# Altium project alarmClock.PrjPcb
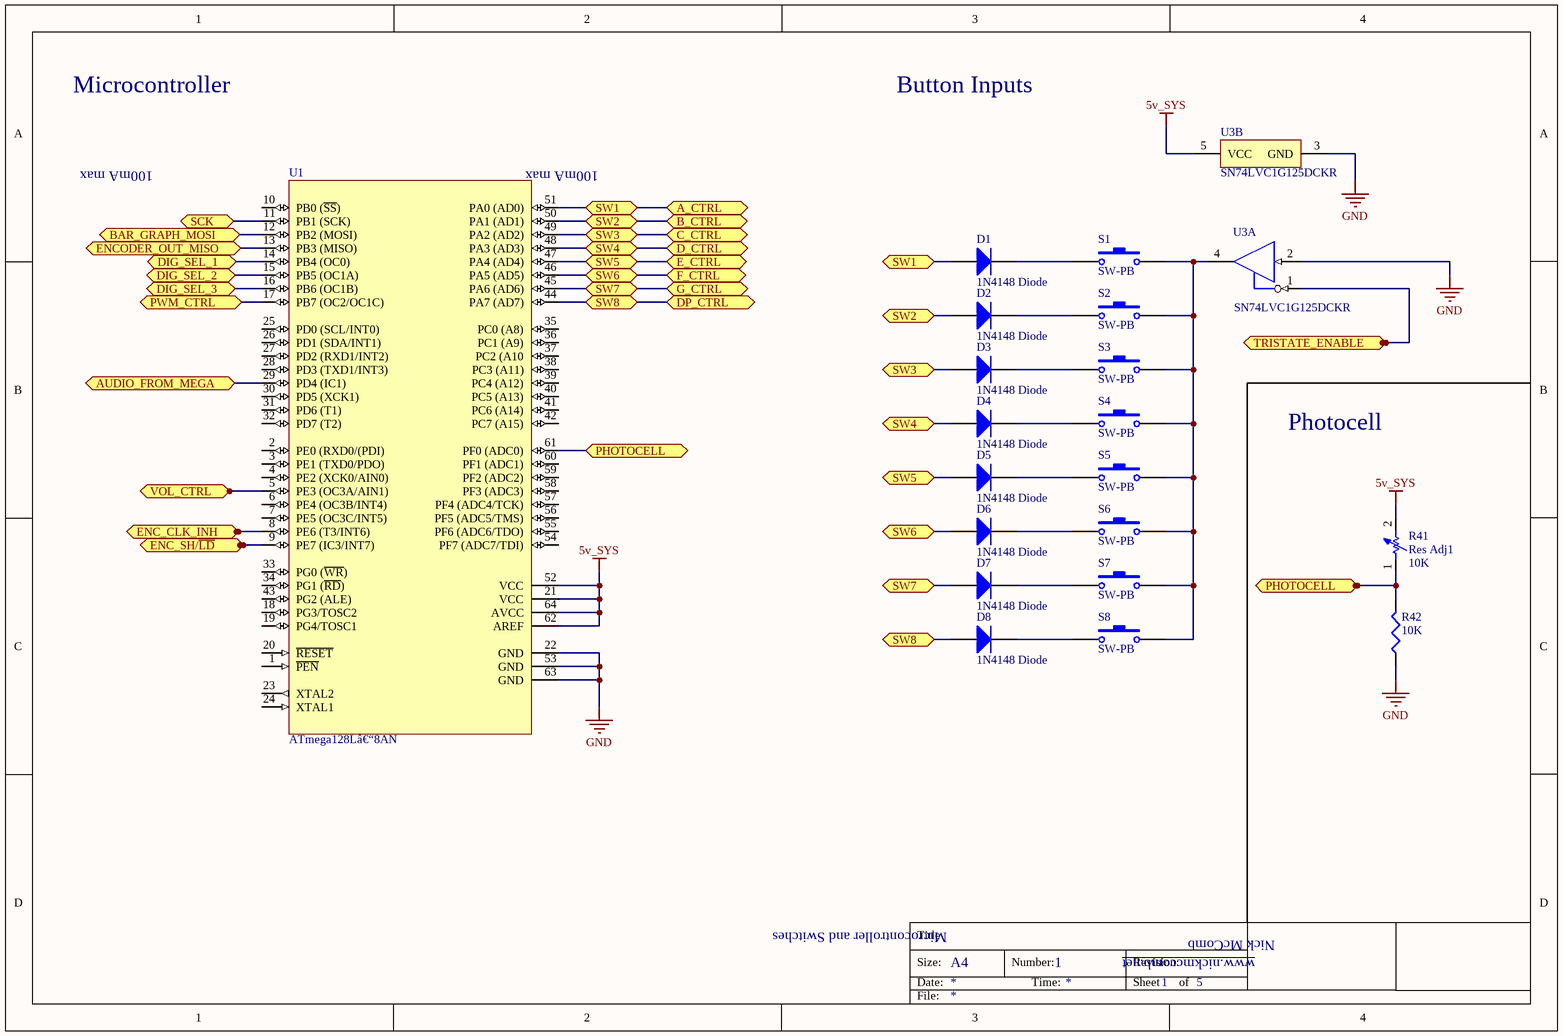
[diagram p0: uC.SchDoc]
5 sheets, 105 parts. Net scope: flat (ports and power ports of the same name join across sheets).
Sheets:
  uC.SchDoc
  barGraph.SchDoc
  7Seg.SchDoc
  encoder.SchDoc
  audioAmp.SchDoc

## Sheet uC.SchDoc
size A4; Organization: Altium Limited; Address1: L3, 12a Rodborough Rd; Address2: Frenchs Forest; Address3: NSW; Address4: Australia 2086; DocumentNumber: 1; SheetNumber: 1; SheetTotal: 5

### Parts
D1  1N4148 Diode  [S01575 Diode]
D2  1N4148 Diode  [S01575 Diode]
D3  1N4148 Diode  [S01575 Diode]
D4  1N4148 Diode  [S01575 Diode]
D5  1N4148 Diode  [S01575 Diode]
D6  1N4148 Diode  [S01575 Diode]
D7  1N4148 Diode  [S01575 Diode]
D8  1N4148 Diode  [S01575 Diode]
R41  Res Adj1  value 10K  [LOG POT]
R42  10K  [J1-0603]
S1  SW-PB  [SW-PB]
S2  SW-PB  [SW-PB]
S3  SW-PB  [SW-PB]
S4  SW-PB  [SW-PB]
S5  SW-PB  [SW-PB]
S6  SW-PB  [SW-PB]
S7  SW-PB  [SW-PB]
S8  SW-PB  [SW-PB]
U1  ATmega128Lâ€“8AN  [64A_M]
U3  SN74LVC1G125DCKR  [DCK0005A_M]  (parts A,B of 2)

### Ports
A_CTRL, AUDIO_FROM_MEGA, B_CTRL, BAR_GRAPH_MOSI, C_CTRL, D_CTRL, DIG_SEL_1, DIG_SEL_2, DIG_SEL_3, DP_CTRL, E_CTRL, ENC_CLK_INH, ENC_SH/~{LD}, ENCODER_OUT_MISO, F_CTRL, G_CTRL, PHOTOCELL, PWM_CTRL, SCK, SW1, SW2, SW3, SW4, SW5, SW6, SW7, SW8, TRISTATE_ENABLE, VOL_CTRL

### Nets
5v_SYS: R41.2 U1.21(VCC) U1.52(VCC) U1.62(AREF) U1.64(AVCC) U3.5(VCC)
GND: R42.1 U1.22(GND) U1.53(GND) U1.63(GND) U3.2(A) U3.3(GND)
NetC3_1: U1.29(PD4_(IC1)) ; port AUDIO_FROM_MEGA
NetD1_1: D1.1(K) S1.1
NetD1_3: D1.3(A) U1.51(PA0_(AD0)) ; port SW1, port A_CTRL
NetD2_1: D2.1(K) S2.1
NetD2_3: D2.3(A) U1.50(PA1_(AD1)) ; port SW2, port B_CTRL
NetD3_1: D3.1(K) S3.1
NetD3_3: D3.3(A) U1.49(PA2_(AD2)) ; port SW3, port C_CTRL
NetD4_1: D4.1(K) S4.1
NetD4_3: D4.3(A) U1.48(PA3_(AD3)) ; port SW4, port D_CTRL
NetD5_1: D5.1(K) S5.1
NetD5_3: D5.3(A) U1.47(PA4_(AD4)) ; port SW5, port E_CTRL
NetD6_1: D6.1(K) S6.1
NetD6_3: D6.3(A) U1.46(PA5_(AD5)) ; port SW6, port F_CTRL
NetD7_1: D7.1(K) S7.1
NetD7_3: D7.3(A) U1.45(PA6_(AD6)) ; port SW7, port G_CTRL
NetD8_1: D8.1(K) S8.1
NetD8_3: D8.3(A) U1.44(PA7_(AD7)) ; port SW8, port DP_CTRL
NetR30_1: U1.17(PB7_(OC2/OC1C)) ; port PWM_CTRL
NetR41_1: R41.1 R42.2 U1.61(PF0_(ADC0)) ; port PHOTOCELL
NetR45_1: U1.5(PE3_(OC3A/AIN1)) ; port VOL_CTRL
NetS1_2: S1.2 S2.2 S3.2 S4.2 S5.2 S6.2 S7.2 S8.2 U3.4(Y)
NetU1_8: U1.8(PE6_(T3/INT6)) ; port ENC_CLK_INH
NetU1_9: U1.9(PE7_(IC3/INT7)) ; port ENC_SH/~{LD}
NetU1_11: U1.11(PB1_(SCK)) ; port SCK
NetU1_12: U1.12(PB2_(MOSI)) ; port BAR_GRAPH_MOSI
NetU1_13: U1.13(PB3_(MISO)) ; port ENCODER_OUT_MISO
NetU1_14: U1.14(PB4_(OC0)) ; port DIG_SEL_1
NetU1_15: U1.15(PB5_(OC1A)) ; port DIG_SEL_2
NetU1_16: U1.16(PB6_(OC1B)) ; port DIG_SEL_3
NetU2_7: U3.1(~{OE}) ; port TRISTATE_ENABLE

Not connected (* = marked no-connect by the designer): U1 1(~{PEN}) 2(PE0_(RXD0/(PDI)) 3(PE1_(TXD0/PDO)) 4(PE2_(XCK0/AIN0)) 6(PE4_(OC3B/INT4)) 7(PE5_(OC3C/INT5)) 10(PB0_(~{SS})) 18(PG3/TOSC2) 19(PG4/TOSC1) 20(~{RESET}) 23(XTAL2) 24(XTAL1) 25(PD0_(SCL/INT0)) 26(PD1_(SDA/INT1)) 27(PD2_(RXD1/INT2)) 28(PD3_(TXD1/INT3)) 30(PD5_(XCK1)) 31(PD6_(T1)) 32(PD7_(T2)) 33(PG0_(~{WR})) 34(PG1_(~{RD})) 35(PC0_(A8)) 36(PC1_(A9)) 37(PC2_(A10) 38(PC3_(A11)) 39(PC4_(A12)) 40(PC5_(A13)) 41(PC6_(A14)) 42(PC7_(A15)) 43(PG2_(ALE)) 54(PF7_(ADC7/TDI)) 55(PF6_(ADC6/TDO)) 56(PF5_(ADC5/TMS)) 57(PF4_(ADC4/TCK)) 58(PF3_(ADC3)) 59(PF2_(ADC2)) 60(PF1_(ADC1))

### Notes on the sheet
- Microcontroller
- Button Inputs
- 100mA max
- Photocell
- Microcontroller and Switches
- Title
- Size:
- Date:
- A4
- Number:
- Time:
- Revision:
- Sheet
- of
- www.nickmccomb.net
- Nick McComb
- File:

### Library data of the parts
D1-D8 = Diode
R41 = Res Adj1: Variable Resistor; ComponentLink1URL: http://cdn.sparkfun.com/datasheets/Sensors/LightImaging/SEN-09088.pdf; ComponentLink1Description: A Photocell Datasheet
R42 = Res3: Resistor; Published: 8-Jun-2000; LatestRevisionDate: 29-May-2009; LatestRevisionNote: IPC-7351 Footprint Added.; PackageReference: J1-0603; Publisher: Altium Limited; PackageDescription: Chip Resistor; Value: 10K
S1-S8 = SW-PB: Switch
U1 = CMP-0095-00651-1: 8-bit AVR Microcontroller, 3.0-5.5V, 128KB Flash, 4KB EEPROM, 4KB SRAM, 64-pin TQFP, Extended Grade (-40°C to 105°C); PackageVersion: revC, Oct-2010; PackageDescription: 64-Pin Plastic Thin Profile Quad Flat Pack, 14 x 14 x 1.0 mm Body, 0.8 mm Pitch (TQFP); Code_JEDEC: MS-026-AEB; ComponentLink3Description: ATmega128(L) Summary; ComponentLink1URL: http://www.atmel.com/; PackageReference: 64A; ComponentLink2URL: http://www.atmel.com/dyn/resources/prod_documents/doc2467.pdf; DatasheetVersion: revX, Jun-2011; ComponentLink3URL: http://www.atmel.com/dyn/resources/prod_documents/2467S.pdf; ComponentLink2Description: ATmega128(L) Datasheet; ComponentLink1Description: Manufacturer URL
U3 = CMP-0859-00281-3: Single Bus Buffer Gate With 3-State Outputs, DCK0005A, LARGE T&R; Manufacturer: Texas Instruments; Bits(#): 1; tpd @ Nom Voltage(Max)(ns): 9,5.5,4.5,4; 3-State Output: Yes; Output Type: CMOS; Sub-Family: Non-Inverting Buffer/Driver; Logic: True; Output Drive (IOL/IOH)(Max)(mA): 32/-32; Voltage(Nom)(V): 1.8,2.5,3.3,5; ICC @ Nom Voltage(Max)(mA): 0.01; Technology Family: LVC; VCC(Min)(V): 1.65; VCC(Max)(V): 5.5; F @ Nom Voltage(Max)(Mhz): 150; Rating: Catalog; Input Type: CMOS/TTL; Schmitt Trigger: No; PackageReference: DCK0005A; Generic Part Number: SN74LVC1G125; DatasheetVersion: SCES223T; Operating Temperature Range(C): -40 to 125,-40 to 85; PartId: 1

## Sheet barGraph.SchDoc
size A4; Organization: Altium Limited; Address1: L3, 12a Rodborough Rd; Address2: Frenchs Forest; Address3: NSW; Address4: Australia 2086; DocumentNumber: 2; SheetNumber: 2; SheetTotal: 5
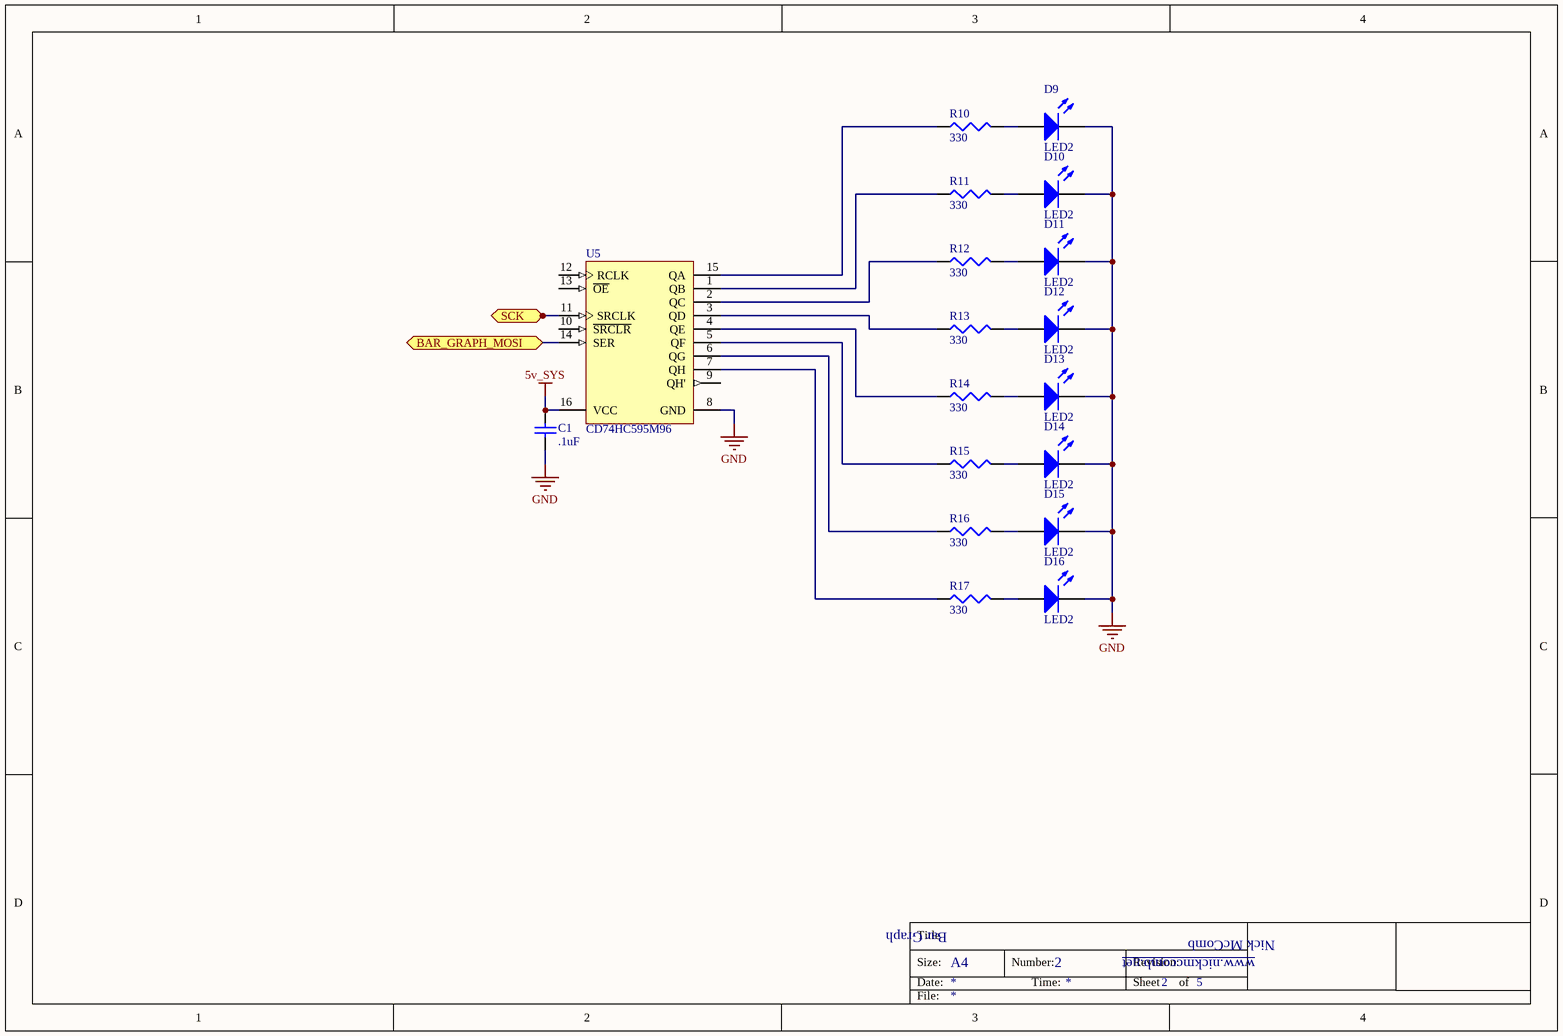
[diagram p1: barGraph.SchDoc]

### Parts
C1  value .1uF  [C0805]  (hidden comment: 0805 style, by default)
D9  LED2  [basic_led]
D10  LED2  [basic_led]
D11  LED2  [basic_led]
D12  LED2  [basic_led]
D13  LED2  [basic_led]
D14  LED2  [basic_led]
D15  LED2  [basic_led]
D16  LED2  [basic_led]
R10  330  [J1-0603]
R11  330  [J1-0603]
R12  330  [J1-0603]
R13  330  [J1-0603]
R14  330  [J1-0603]
R15  330  [J1-0603]
R16  330  [J1-0603]
R17  330  [J1-0603]
U5  CD74HC595M96  [D0016A_L]

### Ports
BAR_GRAPH_MOSI, SCK

### Nets
5v_SYS: C1.2 U5.16(VCC)
GND: C1.1 D9.2(K) D10.2(K) D11.2(K) D12.2(K) D13.2(K) D14.2(K) D15.2(K) D16.2(K) U5.8(GND)
NetD9_1: D9.1(A) R10.2
NetD10_1: D10.1(A) R11.2
NetD11_1: D11.1(A) R12.2
NetD12_1: D12.1(A) R13.2
NetD13_1: D13.1(A) R14.2
NetD14_1: D14.1(A) R15.2
NetD15_1: D15.1(A) R16.2
NetD16_1: D16.1(A) R17.2
NetR10_1: R10.1 U5.15(QA)
NetR11_1: R11.1 U5.1(QB)
NetR12_1: R12.1 U5.2(QC)
NetR13_1: R13.1 U5.3(QD)
NetR14_1: R14.1 U5.4(QE)
NetR15_1: R15.1 U5.5(QF)
NetR16_1: R16.1 U5.6(QG)
NetR17_1: R17.1 U5.7(QH)
NetU1_11: U5.11(SRCLK) ; port SCK
NetU1_12: U5.14(SER) ; port BAR_GRAPH_MOSI

Not connected (* = marked no-connect by the designer): U5 9(QH') 10(~{SRCLR}) 12(RCLK) 13(~{OE})

### Notes on the sheet
- Bar Graph
- Title
- Size:
- Date:
- A4
- Number:
- Time:
- Revision:
- Sheet
- of
- www.nickmccomb.net
- Nick McComb
- File:

### Library data of the parts
C1 = Cap: Capacitor; Published: 8-Jun-2000; LatestRevisionDate: 17-Jul-2002; LatestRevisionNote: Re-released for DXP Platform.; PackageReference: RAD-0.3; Publisher: Altium Limited; PackageDescription: Radial Cap, Thru-Hole; 2 Leads; 0.3 in Pin Spacing
D9-D16 = LED2: Typical RED, GREEN, YELLOW, AMBER GaAs LED; Published: 8-Jun-2000; LatestRevisionDate: 17-Jul-2002; LatestRevisionNote: Re-released for DXP Platform.; PackageVersion: Feb-2002; PackageReference: 3.2X1.6X1.1; Publisher: Altium Limited; PackageDescription: SM LED; 2 Flat Leads
R10-R17 = Res3: Resistor; Published: 8-Jun-2000; LatestRevisionDate: 29-May-2009; LatestRevisionNote: IPC-7351 Footprint Added.; PackageReference: J1-0603; Publisher: Altium Limited; PackageDescription: Chip Resistor; Value: 330
U5 = CMP-0807-00025-1: 8-Bit Shift Registers With 3-State Output Registers, D0016A, LARGE T&R; ICC @ Nom Voltage(Max)(mA): 0.08; 3-State Output: Yes; Input Type: CMOS; VCC(Max)(V): 6; Bits: 8; No. of Outputs: 9; VCC(Min)(V): 2; F @ Nom Voltage(Max)(Mhz): 28; Technology Family: HC; tpd @ Nom Voltage(Max)(ns): 41; Output Drive (IOL/IOH)(Max)(mA): 7.8/-7.8; Rating: Catalog; PackageVersion: http://www.ti.com/lit/ml/mpds178g/mpds178g.pdf; Code_IPC: MS-012 variation AC; Operating Temperature Range(C): -55 to 125; ComponentLink2Description: Datasheet; ComponentLink1Description: Manufacturer URL; ComponentLink2URL: http://www.ti.com/lit/ds/symlink/cd74hc595.pdf; PackageReference: D0016A; PartNumber: CD74HC595M96; Part Number: CD74HC595; DatasheetVersion: SCHS353; ComponentLink1URL: http://www.ti.com/; Output Type: CMOS; Voltage(Nom)(V): 6

## Sheet 7Seg.SchDoc
size A4; Organization: Altium Limited; Address1: L3, 12a Rodborough Rd; Address2: Frenchs Forest; Address3: NSW; Address4: Australia 2086; DocumentNumber: 3; SheetNumber: 3; SheetTotal: 5
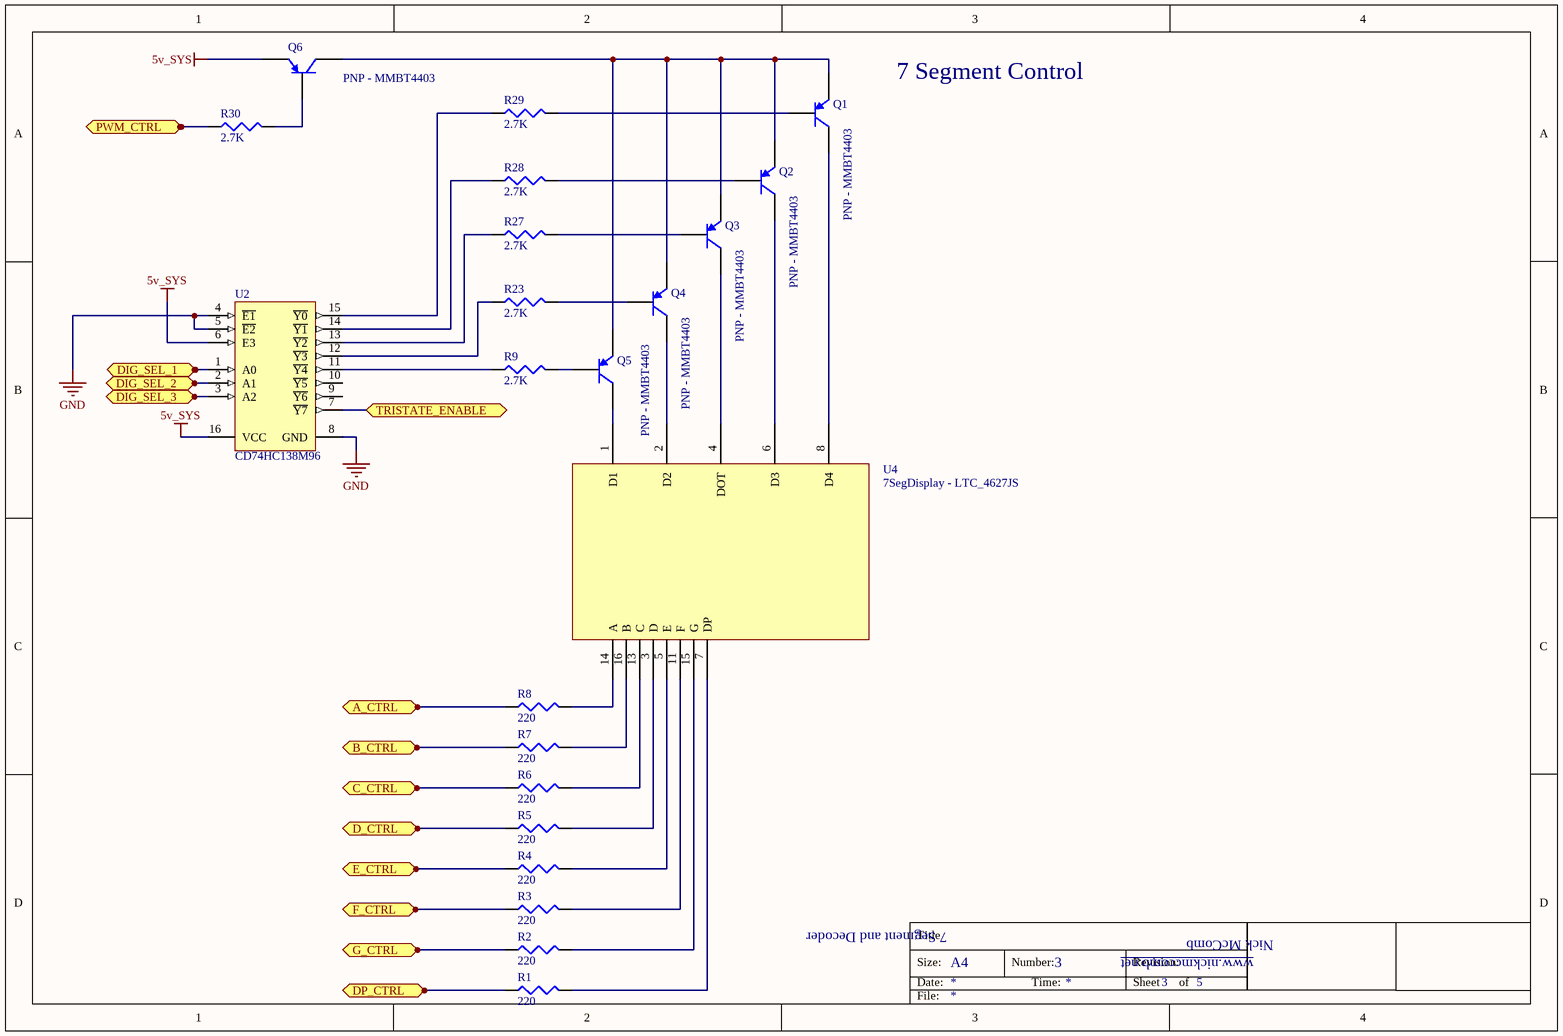
[diagram p2: 7Seg.SchDoc]

### Parts
Q1  PNP - MMBT4403  [TO-92A - BJT]
Q2  PNP - MMBT4403  [TO-92A - BJT]
Q3  PNP - MMBT4403  [TO-92A - BJT]
Q4  PNP - MMBT4403  [TO-92A - BJT]
Q5  PNP - MMBT4403  [TO-92A - BJT]
Q6  PNP - MMBT4403  [TO-92A - BJT]
R1  220  [J1-0603]
R2  220  [J1-0603]
R3  220  [J1-0603]
R4  220  [J1-0603]
R5  220  [J1-0603]
R6  220  [J1-0603]
R7  220  [J1-0603]
R8  220  [J1-0603]
R9  2.7K  [J1-0603]
R23  2.7K  [J1-0603]
R27  2.7K  [J1-0603]
R28  2.7K  [J1-0603]
R29  2.7K  [J1-0603]
R30  2.7K  [J1-0603]
U2  CD74HC138M96  [D0016A_L]
U4  7SegDisplay - LTC_4627JS

### Ports
A_CTRL, B_CTRL, C_CTRL, D_CTRL, DIG_SEL_1, DIG_SEL_2, DIG_SEL_3, DP_CTRL, E_CTRL, F_CTRL, G_CTRL, PWM_CTRL, TRISTATE_ENABLE

### Nets
5v_SYS: Q6.3(E) U2.6(E3) U2.16(VCC)
GND: U2.4(~{E1}) U2.5(~{E2}) U2.8(GND)
NetD1_3: R8.1 ; port A_CTRL
NetD2_3: R7.1 ; port B_CTRL
NetD3_3: R6.1 ; port C_CTRL
NetD4_3: R5.1 ; port D_CTRL
NetD5_3: R4.1 ; port E_CTRL
NetD6_3: R3.1 ; port F_CTRL
NetD7_3: R2.1 ; port G_CTRL
NetD8_3: R1.1 ; port DP_CTRL
NetQ1_1: Q1.1(C) U4.8(D4)
NetQ1_2: Q1.2(B) R29.2
NetQ1_3: Q1.3(E) Q2.3(E) Q3.3(E) Q4.3(E) Q5.3(E) Q6.1(C)
NetQ2_1: Q2.1(C) U4.6(D3)
NetQ2_2: Q2.2(B) R28.2
NetQ3_1: Q3.1(C) U4.4(DOT)
NetQ3_2: Q3.2(B) R27.2
NetQ4_1: Q4.1(C) U4.2(D2)
NetQ4_2: Q4.2(B) R23.2
NetQ5_1: Q5.1(C) U4.1(D1)
NetQ5_2: Q5.2(B) R9.2
NetQ6_2: Q6.2(B) R30.2
NetR1_2: R1.2 U4.7(DP)
NetR2_2: R2.2 U4.15(G)
NetR3_2: R3.2 U4.11(F)
NetR4_2: R4.2 U4.5(E)
NetR5_2: R5.2 U4.3(D)
NetR6_2: R6.2 U4.13(C)
NetR7_2: R7.2 U4.16(B)
NetR8_2: R8.2 U4.14(A)
NetR9_1: R9.1 U2.11(~{Y4})
NetR23_1: R23.1 U2.12(~{Y3})
NetR27_1: R27.1 U2.13(~{Y2})
NetR28_1: R28.1 U2.14(~{Y1})
NetR29_1: R29.1 U2.15(~{Y0})
NetR30_1: R30.1 ; port PWM_CTRL
NetU1_14: U2.1(A0) ; port DIG_SEL_1
NetU1_15: U2.2(A1) ; port DIG_SEL_2
NetU1_16: U2.3(A2) ; port DIG_SEL_3
NetU2_7: U2.7(~{Y7}) ; port TRISTATE_ENABLE

Not connected (* = marked no-connect by the designer): U2 9(~{Y6}) 10(~{Y5})

### Notes on the sheet
- 7 Segment Control
- 7 Segment and Decoder
- Title
- Size:
- Date:
- A4
- Number:
- Time:
- Revision:
- Sheet
- of
- www.nickmccomb.net
- Nick McComb
- File:

### Library data of the parts
Q1-Q6 = PNP - MMBT4403: PNP Bipolar Transistor
R1-R9 R23 R27-R30 = Res3: Resistor; Published: 8-Jun-2000; LatestRevisionDate: 29-May-2009; LatestRevisionNote: IPC-7351 Footprint Added.; PackageReference: J1-0603; Publisher: Altium Limited; PackageDescription: Chip Resistor
  R1-R8: Value: 220
  R9 R23 R27-R30: Value: 2.7K
U2 = CMP-1633-00157-2: High Speed CMOS Logic 3-to-8 Line Decoder Demultiplexer Inverting and Non-Inverting, D0016A, LARGE T&R; Manufacturer: Texas Instruments; VCC(Max)(V): 6; Technology Family: HC; Function: Decoder/Demultiplexer; tpd @ Nom Voltage(Max)(ns): 30; ICC @ Nom Voltage(Max)(mA): 0.08; Input Type: LVTTL/CMOS; Configuration: 3：8; Voltage(Nom)(V): 3.3,5; Schmitt Trigger: No; Channels(#): 1; Output Drive (IOL/IOH)(Max)(mA): 5.2/-5.2; F @ Nom Voltage(Max)(Mhz): 28; VCC(Min)(V): 2; Bits(#): 8; Rating: Catalog; PackageReference: D0016A; Operating Temperature Range(C): -55 to 125; Code_JEDEC: MS-012 variation AC; Generic Part Number: CD74HC138; Output Type: CMOS; DatasheetVersion: SCHS147I; Type: Standard
U4 = 7SegDisplay

## Sheet encoder.SchDoc
size A4; Organization: Altium Limited; Address1: L3, 12a Rodborough Rd; Address2: Frenchs Forest; Address3: NSW; Address4: Australia 2086; DocumentNumber: 4; SheetNumber: 4; SheetTotal: 5
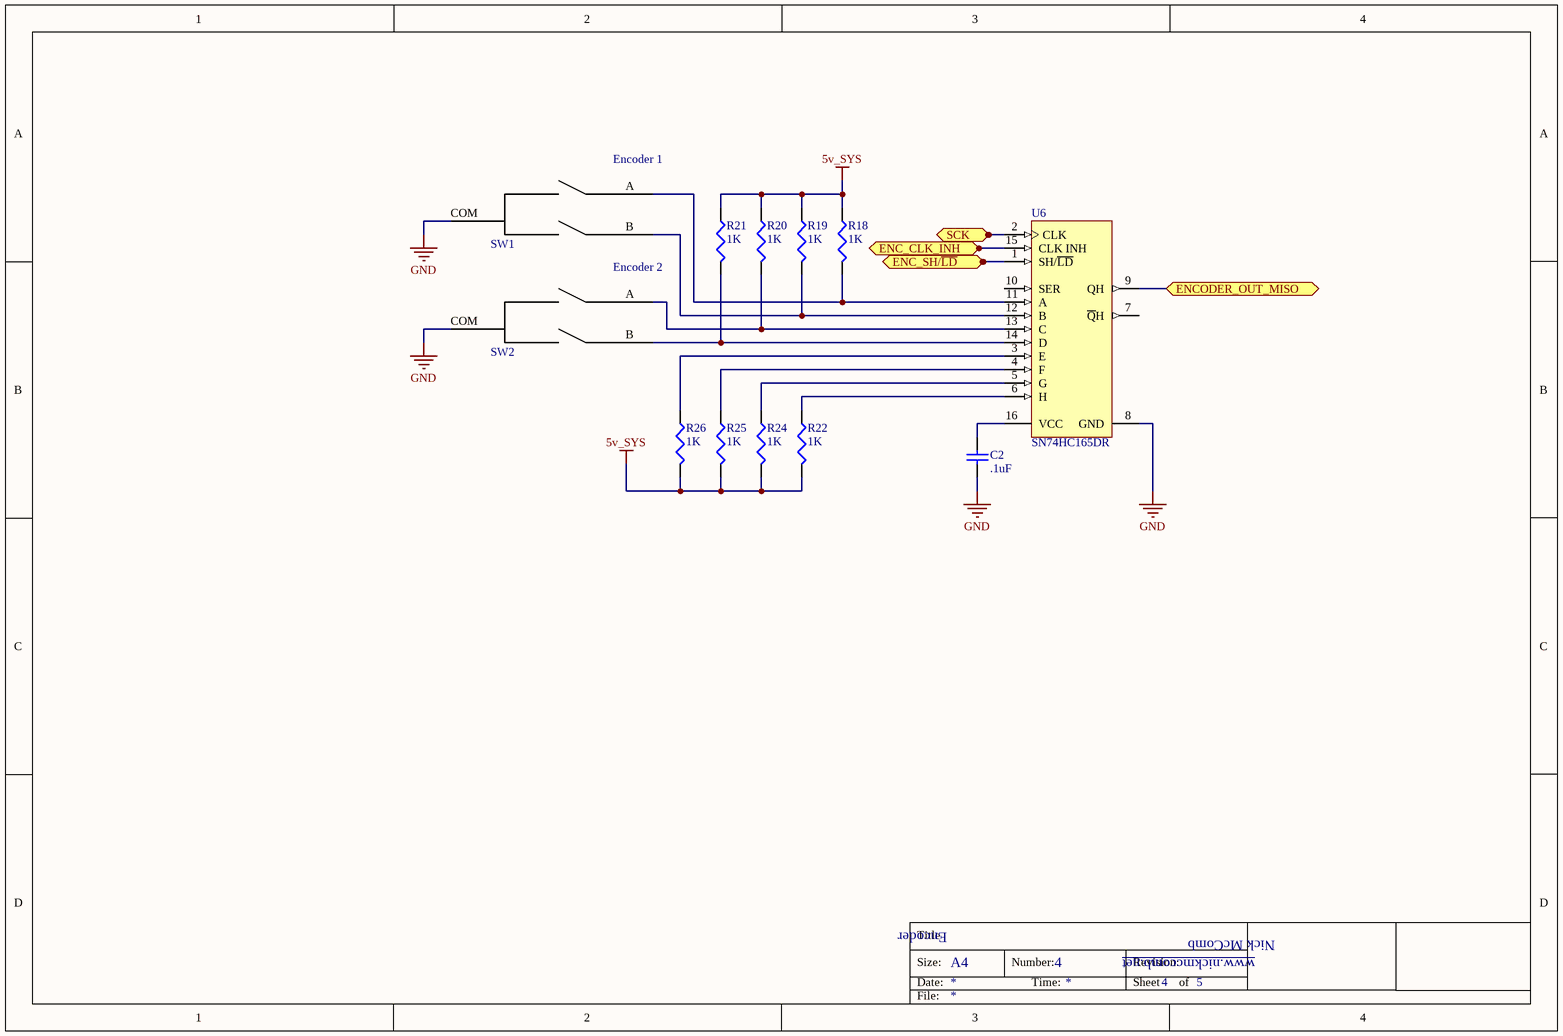
[diagram p3: encoder.SchDoc]

### Parts
C2  value .1uF  [C0805]  (hidden comment: 0805 style, by default)
R18  1K  [J1-0603]
R19  1K  [J1-0603]
R20  1K  [J1-0603]
R21  1K  [J1-0603]
R22  1K  [J1-0603]
R24  1K  [J1-0603]
R25  1K  [J1-0603]
R26  1K  [J1-0603]
SW1  ENCODER  (value not drawn)
SW2  ENCODER  (value not drawn)
U6  SN74HC165DR  [D0016A_L]

### Ports
ENC_CLK_INH, ENC_SH/~{LD}, ENCODER_OUT_MISO, SCK

### Nets
5v_SYS: R18.2 R19.2 R20.2 R21.2 R22.1 R24.1 R25.1 R26.1
GND: C2.1 SW1.COM SW2.COM U6.8(GND)
NetC2_2: C2.2 U6.16(VCC)
NetR18_1: R18.1 SW1.A U6.11(A)
NetR19_1: R19.1 SW1.B U6.12(B)
NetR20_1: R20.1 SW2.A U6.13(C)
NetR21_1: R21.1 SW2.B U6.14(D)
NetR22_2: R22.2 U6.6(H)
NetR24_2: R24.2 U6.5(G)
NetR25_2: R25.2 U6.4(F)
NetR26_2: R26.2 U6.3(E)
NetU1_8: U6.15(CLK_INH) ; port ENC_CLK_INH
NetU1_9: U6.1(SH/~{LD}) ; port ENC_SH/~{LD}
NetU1_11: U6.2(CLK) ; port SCK
NetU1_13: U6.9(QH) ; port ENCODER_OUT_MISO

Not connected (* = marked no-connect by the designer): U6 7(~{Q}H) 10(SER)

### Notes on the sheet
- (near SW1) Encoder 1
- Encoder 2
- Encoder
- Title
- Size:
- Date:
- A4
- Number:
- Time:
- Revision:
- Sheet
- of
- www.nickmccomb.net
- Nick McComb
- File:

### Library data of the parts
C2 = Cap: Capacitor; Published: 8-Jun-2000; LatestRevisionDate: 17-Jul-2002; LatestRevisionNote: Re-released for DXP Platform.; PackageReference: RAD-0.3; Publisher: Altium Limited; PackageDescription: Radial Cap, Thru-Hole; 2 Leads; 0.3 in Pin Spacing
R18-R22 R24-R26 = Res3: Resistor; Published: 8-Jun-2000; LatestRevisionDate: 29-May-2009; LatestRevisionNote: IPC-7351 Footprint Added.; PackageReference: J1-0603; Publisher: Altium Limited; PackageDescription: Chip Resistor; Value: 1K
U6 = CMP-0780-00020-1: 8-Bit Parallel-Load Shift Registers, D0016A, LARGE T&R; F @ Nom Voltage(Max)(Mhz): 28; Rating: Catalog; VCC(Max)(V): 6; VCC(Min)(V): 2; tpd @ Nom Voltage(Max)(ns): 38; Output Drive (IOL/IOH)(Max)(mA): 5.2/-5.2; Bits: 8; 3-State Output: No; Output Type: CMOS; ICC @ Nom Voltage(Max)(mA): 0.08; Technology Family: HC; Operating Temperature Range(C): -40 to 125; PartNumber: SN74HC165DR; Code_IPC: MS-012 variation AC; PackageReference: D0016A; ComponentLink1Description: Manufacturer URL; ComponentLink2URL: http://www.ti.com/lit/ds/symlink/sn74hc165.pdf; Input Type: CMOS; ComponentLink2Description: Datasheet; PackageVersion: http://www.ti.com/lit/ml/mpds178g/mpds178g.pdf; Part Number: SN74HC165; ComponentLink1URL: http://www.ti.com/; Voltage(Nom)(V): 6; DatasheetVersion: SCLS116G

## Sheet audioAmp.SchDoc
size A4; Organization: Altium Limited; Address1: L3, 12a Rodborough Rd; Address2: Frenchs Forest; Address3: NSW; Address4: Australia 2086; DocumentNumber: 5; SheetNumber: 5; SheetTotal: 5
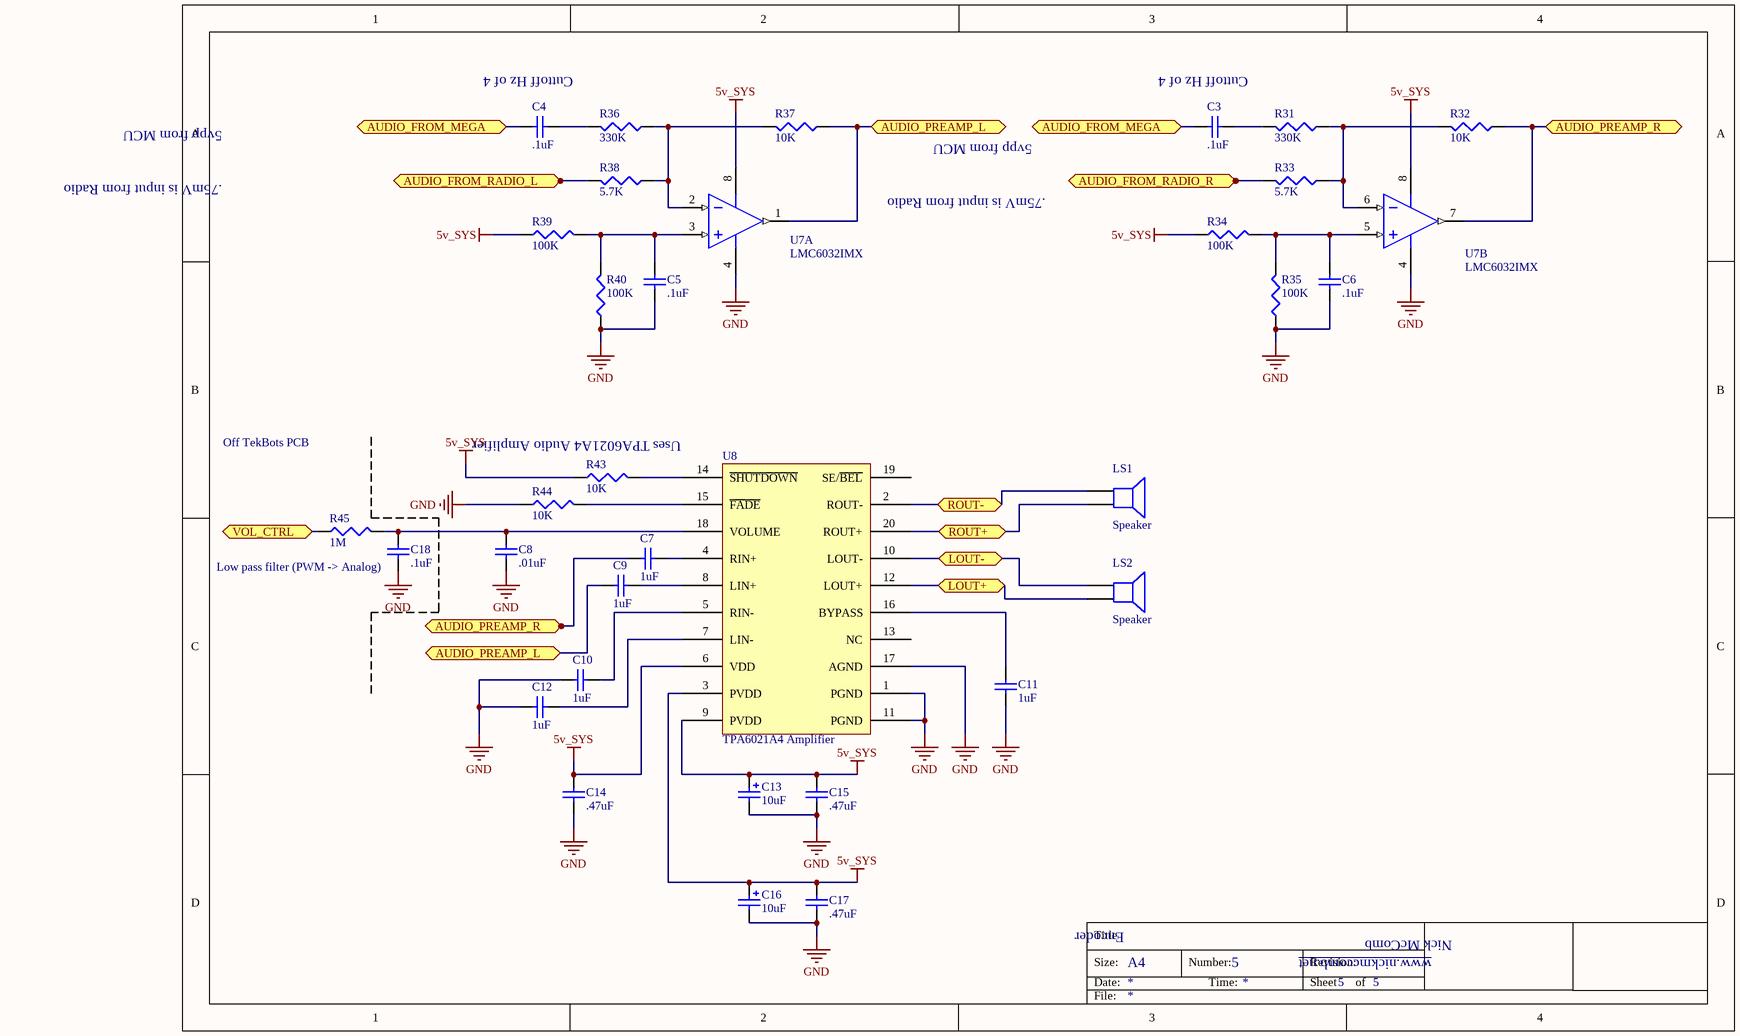
[diagram p4: audioAmp.SchDoc]

### Parts
C3  value .1uF  [C0805]  (hidden comment: 0805 style, by default)
C4  value .1uF  [C0805]  (hidden comment: 0805 style, by default)
C5  value .1uF  [C0805]  (hidden comment: 0805 style, by default)
C6  value .1uF  [C0805]  (hidden comment: 0805 style, by default)
C7  value 1uF  [C0805]  (hidden comment: 0805 style, by default)
C8  value .01uF  [C0805]  (hidden comment: 0805 style, by default)
C9  value 1uF  [C0805]  (hidden comment: 0805 style, by default)
C10  value 1uF  [C0805]  (hidden comment: 0805 style, by default)
C11  value 1uF  [C0805]  (hidden comment: 0805 style, by default)
C12  value 1uF  [C0805]  (hidden comment: 0805 style, by default)
C13  10uF
C14  value .47uF  [C0805]  (hidden comment: 0805 style, by default)
C15  value .47uF  [C0805]  (hidden comment: 0805 style, by default)
C16  10uF
C17  value .47uF  [C0805]  (hidden comment: 0805 style, by default)
C18  value .1uF  [C0805]  (hidden comment: 0805 style, by default)
LS1  Speaker  [PIN2]
LS2  Speaker  [PIN2]
R31  330K  [J1-0603]
R32  10K  [J1-0603]
R33  5.7K  [J1-0603]
R34  100K  [J1-0603]
R35  100K  [J1-0603]
R36  330K  [J1-0603]
R37  10K  [J1-0603]
R38  5.7K  [J1-0603]
R39  100K  [J1-0603]
R40  100K  [J1-0603]
R43  10K  [J1-0603]
R44  10K  [J1-0603]
R45  1M  [J1-0603]
U7  LMC6032IMX  [D0008A_M]  (parts A,B of 2)
U8  TPA6021A4 Amplifier

### Ports
AUDIO_FROM_MEGA, AUDIO_FROM_RADIO_L, AUDIO_FROM_RADIO_R, AUDIO_PREAMP_L, AUDIO_PREAMP_R, LOUT+, LOUT-, ROUT+, ROUT-, VOL_CTRL

### Nets
5v_SYS: C13.1 C14.2 C15.2 C16.1 C17.2 R34.1 R39.1 R43.1 U7.8(V+) U8.3(PVDD) U8.6(VDD) U8.9(PVDD)
GND: C5.1 C6.1 C8.1 C10.1 C11.1 C12.1 C13.2 C14.1 C15.1 C16.2 C17.1 C18.1 R35.1 R40.1 R44.1 U7.4(V-) U8.1(PGND) U8.11(PGND) U8.17(AGND)
NetC3_1: C3.1 C4.1 ; port AUDIO_FROM_MEGA
NetC3_2: C3.2 R31.2
NetC4_2: C4.2 R36.2
NetC5_2: C5.2 R39.2 R40.2 U7.3(INA+)
NetC6_2: C6.2 R34.2 R35.2 U7.5(INB+)
NetC7_1: C7.1 R32.1 U7.7(OUTB) ; port AUDIO_PREAMP_R
NetC7_2: C7.2 U8.4(RIN+)
NetC8_2: C8.2 C18.2 R45.2 U8.18(VOLUME)
NetC9_1: C9.1 R37.1 U7.1(OUTA) ; port AUDIO_PREAMP_L
NetC9_2: C9.2 U8.8(LIN+)
NetC10_2: C10.2 U8.5(RIN-)
NetC11_2: C11.2 U8.16(BYPASS)
NetC12_2: C12.2 U8.7(LIN-)
NetLS1_1: LS1.1 U8.2(ROUT-) ; port ROUT-
NetLS1_2: LS1.2 U8.20(ROUT+) ; port ROUT+
NetLS2_1: LS2.1 U8.10(LOUT-) ; port LOUT-
NetLS2_2: LS2.2 U8.12(LOUT+) ; port LOUT+
NetR31_1: R31.1 R32.2 R33.1 U7.6(INB-)
NetR33_2: R33.2 ; port AUDIO_FROM_RADIO_R
NetR36_1: R36.1 R37.2 R38.1 U7.2(INA-)
NetR38_2: R38.2 ; port AUDIO_FROM_RADIO_L
NetR43_2: R43.2 U8.14(~{SHUTDOWN})
NetR44_2: R44.2 U8.15(~{FADE})
NetR45_1: R45.1 ; port VOL_CTRL

Not connected (* = marked no-connect by the designer): U8 13(NC) 19(SE/~{BEL})

### Notes on the sheet
- Cuttoff Hz of 4
- .75mV is input from Radio
- 5vpp from MCU
- (near R34) .75mV is input from Radio
- Off TekBots PCB
- (near U8) Uses TPA6021A4 Audio Amplifier
- (near C18) Low pass filter (PWM -> Analog)
- Encoder
- Title
- Size:
- Date:
- A4
- Number:
- Time:
- Revision:
- Sheet
- of
- www.nickmccomb.net
- Nick McComb
- File:

### Library data of the parts
C3-C12 C14 C15 C17 C18 = Cap: Capacitor; Published: 8-Jun-2000; LatestRevisionDate: 17-Jul-2002; LatestRevisionNote: Re-released for DXP Platform.; PackageReference: RAD-0.3; Publisher: Altium Limited; PackageDescription: Radial Cap, Thru-Hole; 2 Leads; 0.3 in Pin Spacing
C13 C16 = Cap Pol: Polarized Capacitor (Radial); Value: 10uF
LS1 LS2 = Speaker: Loudspeaker; Published: 24-Mar-1999; LatestRevisionDate: 17-Jul-2002; LatestRevisionNote: Re-released for DXP Platform.; PackageReference: PIN2; Publisher: Altium Limited
R31-R40 R43-R45 = Res3: Resistor; Published: 8-Jun-2000; LatestRevisionDate: 29-May-2009; LatestRevisionNote: IPC-7351 Footprint Added.; PackageReference: J1-0603; Publisher: Altium Limited; PackageDescription: Chip Resistor
  R31 R36: Value: 330K
  R32 R37 R43 R44: Value: 10K
  R33 R38: Value: 5.7K
  R34 R35 R39 R40: Value: 100K
  R45: Value: 1M
U7 = CMP-0055-00692-3: CMOS Dual Operational Amplifier, 8-pin Narrow SOIC; Manufacturer: Texas Instruments; PowerWise: N; PackageTopMarking: NSZXTT*LMC60*32IM; CompType: Amplifiers; PinCount: 8; ComponentLink1URL: http://www.ti.com/general/docs/lit/getliterature.tsp?genericPartNumber=LMC6032&fileType=pdf; Package Reference: D0008A; Code_JEDEC: MS-012-AA; Code_IPC: SOIC127P600-8; ComponentLink1Description: Datasheet URL; PackageDescription: SOIC Narrow, 4.9 x 3.9 x 1.45mm, 8 Lead, 1.27mm Pitch; RoHS: N; PartId: 1
U8 = TPA6021A4 Amplifier: Audio Amplifier

## Nets that join several sheets
5v_SYS: uC (6 pins), barGraph (C1.2 U5.16), 7Seg (Q6.3 U2.6 U2.16), encoder (8 pins), audioAmp (12 pins)
GND: uC (6 pins), barGraph (10 pins), 7Seg (U2.4 U2.5 U2.8), encoder (C2.1 SW1.COM SW2.COM U6.8), audioAmp (19 pins)
NetC3_1: uC (U1.29), audioAmp (C3.1 C4.1)
NetD1_3: uC (D1.3 U1.51), 7Seg (R8.1)
NetD2_3: uC (D2.3 U1.50), 7Seg (R7.1)
NetD3_3: uC (D3.3 U1.49), 7Seg (R6.1)
NetD4_3: uC (D4.3 U1.48), 7Seg (R5.1)
NetD5_3: uC (D5.3 U1.47), 7Seg (R4.1)
NetD6_3: uC (D6.3 U1.46), 7Seg (R3.1)
NetD7_3: uC (D7.3 U1.45), 7Seg (R2.1)
NetD8_3: uC (D8.3 U1.44), 7Seg (R1.1)
NetR30_1: uC (U1.17), 7Seg (R30.1)
NetR45_1: uC (U1.5), audioAmp (R45.1)
NetU1_8: uC (U1.8), encoder (U6.15)
NetU1_9: uC (U1.9), encoder (U6.1)
NetU1_11: uC (U1.11), barGraph (U5.11), encoder (U6.2)
NetU1_12: uC (U1.12), barGraph (U5.14)
NetU1_13: uC (U1.13), encoder (U6.9)
NetU1_14: uC (U1.14), 7Seg (U2.1)
NetU1_15: uC (U1.15), 7Seg (U2.2)
NetU1_16: uC (U1.16), 7Seg (U2.3)
NetU2_7: uC (U3.1), 7Seg (U2.7)